# Altium project SPARTAN_BOARD.PrjPcb
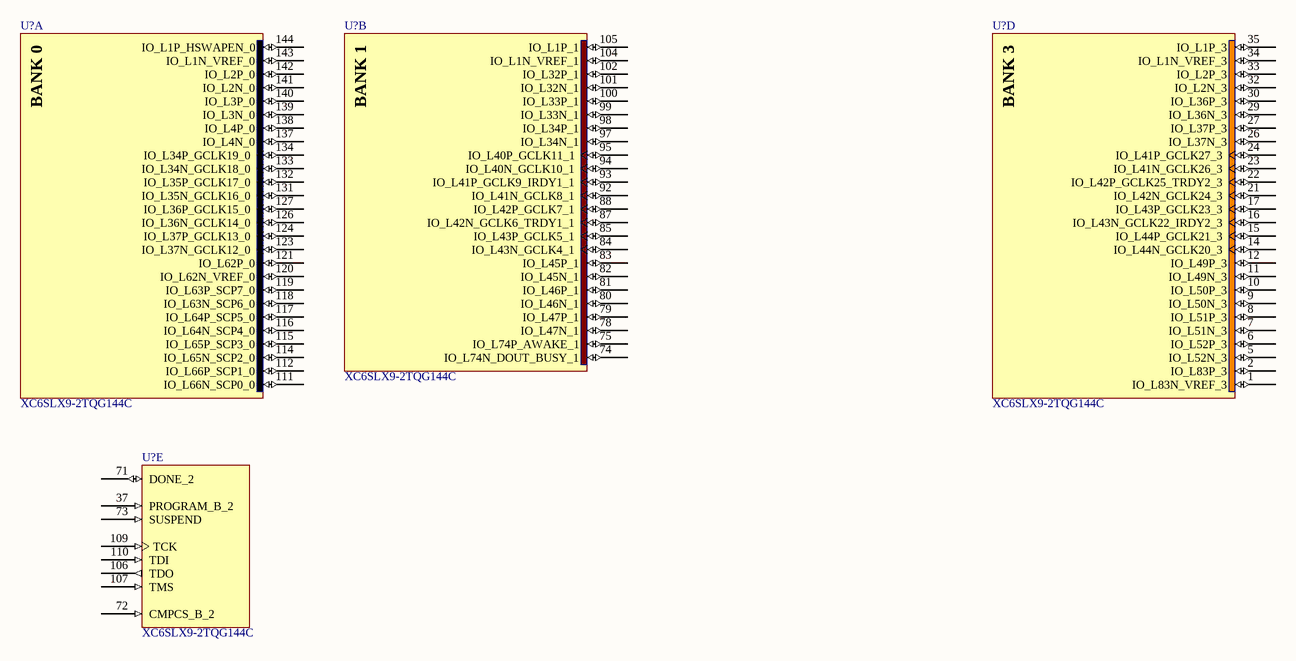
[diagram p0: Sheet1.SchDoc]
3 sheets, 33 parts. Net scope: global (net labels, ports and power ports of the same name join across sheets).
Sheets:
  Sheet1.SchDoc
  FPGA_POWER.SchDoc
  FPGA_FLASH.SchDoc

## Sheet Sheet1.SchDoc
size A4; SheetNumber: 1; SheetTotal: 3

### Parts
(Parts that share a designator on the sheet are numbered #1, #2 ... from top to bottom, then left to right.)
U?#1  XC6SLX9-2TQG144C  [TQG144_N]  (part A of 7)
U?#2  XC6SLX9-2TQG144C  [TQG144_N]  (part B of 7)
U?#3  XC6SLX9-2TQG144C  [TQG144_N]  (part D of 7)
U?#4  XC6SLX9-2TQG144C  [TQG144_N]  (part E of 7)

### Nets

Not connected (* = marked no-connect by the designer): U?#1 111(IO_L66N_SCP0_0) 112(IO_L66P_SCP1_0) 114(IO_L65N_SCP2_0) 115(IO_L65P_SCP3_0) 116(IO_L64N_SCP4_0) 117(IO_L64P_SCP5_0) 118(IO_L63N_SCP6_0) 119(IO_L63P_SCP7_0) 120(IO_L62N_VREF_0) 121(IO_L62P_0) 123(IO_L37N_GCLK12_0) 124(IO_L37P_GCLK13_0) 126(IO_L36N_GCLK14_0) 127(IO_L36P_GCLK15_0) 131(IO_L35N_GCLK16_0) 132(IO_L35P_GCLK17_0) 133(IO_L34N_GCLK18_0) 134(IO_L34P_GCLK19_0) 137(IO_L4N_0) 138(IO_L4P_0) 139(IO_L3N_0) 140(IO_L3P_0) 141(IO_L2N_0) 142(IO_L2P_0) 143(IO_L1N_VREF_0) 144(IO_L1P_HSWAPEN_0); U?#2 74(IO_L74N_DOUT_BUSY_1) 75(IO_L74P_AWAKE_1) 78(IO_L47N_1) 79(IO_L47P_1) 80(IO_L46N_1) 81(IO_L46P_1) 82(IO_L45N_1) 83(IO_L45P_1) 84(IO_L43N_GCLK4_1) 85(IO_L43P_GCLK5_1) 87(IO_L42N_GCLK6_TRDY1_1) 88(IO_L42P_GCLK7_1) 92(IO_L41N_GCLK8_1) 93(IO_L41P_GCLK9_IRDY1_1) 94(IO_L40N_GCLK10_1) 95(IO_L40P_GCLK11_1) 97(IO_L34N_1) 98(IO_L34P_1) 99(IO_L33N_1) 100(IO_L33P_1) 101(IO_L32N_1) 102(IO_L32P_1) 104(IO_L1N_VREF_1) 105(IO_L1P_1); U?#3 1(IO_L83N_VREF_3) 2(IO_L83P_3) 5(IO_L52N_3) 6(IO_L52P_3) 7(IO_L51N_3) 8(IO_L51P_3) 9(IO_L50N_3) 10(IO_L50P_3) 11(IO_L49N_3) 12(IO_L49P_3) 14(IO_L44N_GCLK20_3) 15(IO_L44P_GCLK21_3) 16(IO_L43N_GCLK22_IRDY2_3) 17(IO_L43P_GCLK23_3) 21(IO_L42N_GCLK24_3) 22(IO_L42P_GCLK25_TRDY2_3) 23(IO_L41N_GCLK26_3) 24(IO_L41P_GCLK27_3) 26(IO_L37N_3) 27(IO_L37P_3) 29(IO_L36N_3) 30(IO_L36P_3) 32(IO_L2N_3) 33(IO_L2P_3) 34(IO_L1N_VREF_3) 35(IO_L1P_3); U?#4 37(PROGRAM_B_2) 71(DONE_2) 72(CMPCS_B_2) 73(SUSPEND) 106(TDO) 107(TMS) 109(TCK) 110(TDI)

### Notes on the sheet
- (in symbol CMP-0067-00454-1, part A) BANK 0
- (in symbol CMP-0067-00454-1, part B) BANK 1
- (in symbol CMP-0067-00454-1, part D) BANK 3

### Library data of the parts
U?#1-U?#4 = CMP-0067-00454-1: Spartan-6 LX 1.2V FPGA, 102 User I/Os, 144-Pin TQFP (0.5mm Pitch), Speed Grade 2, Commercial Grade, Pb-Free; PackageVersion: ver1.2, Jun-2004; DatasheetVersion: ver1.6, Nov-2010; PackageDescription: 144-Pin Thin Quad Flat Pack (TQG144) - Pb-Free; PackageReference: TQG144; Code_JEDEC: MS-026-BFB

## Sheet FPGA_POWER.SchDoc
size A; SheetNumber: 2; SheetTotal: 2
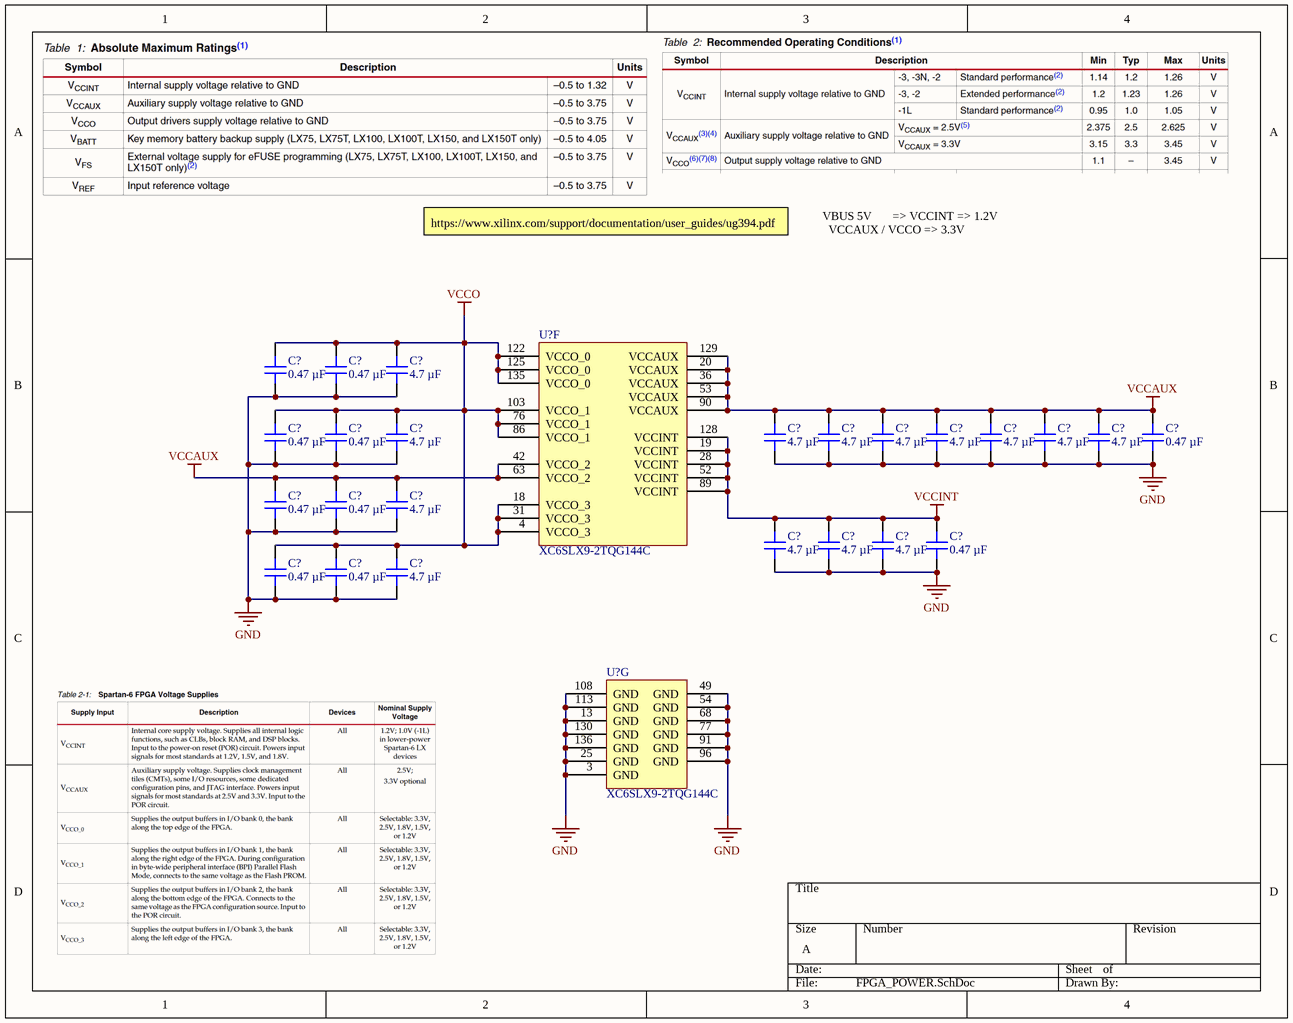
[diagram p1: FPGA_POWER.SchDoc]

### Parts
(Parts that share a designator on the sheet are numbered #1, #2 ... from top to bottom, then left to right.)
C?#1  0.47 µF  [CAP 0402_1005]
C?#2  0.47 µF  [CAP 0402_1005]
C?#3  4.7 µF  [CAP 0805_2012]
C?#4  0.47 µF  [CAP 0402_1005]
C?#5  0.47 µF  [CAP 0402_1005]
C?#6  4.7 µF  [CAP 0805_2012]
C?#7  4.7 µF  [CAP 0805_2012]
C?#8  4.7 µF  [CAP 0805_2012]
C?#9  4.7 µF  [CAP 0805_2012]
C?#10  4.7 µF  [CAP 0805_2012]
C?#11  4.7 µF  [CAP 0805_2012]
C?#12  4.7 µF  [CAP 0805_2012]
C?#13  4.7 µF  [CAP 0805_2012]
C?#14  0.47 µF  [CAP 0402_1005]
C?#15  0.47 µF  [CAP 0402_1005]
C?#16  0.47 µF  [CAP 0402_1005]
C?#17  4.7 µF  [CAP 0805_2012]
C?#18  4.7 µF  [CAP 0805_2012]
C?#19  4.7 µF  [CAP 0805_2012]
C?#20  4.7 µF  [CAP 0805_2012]
C?#21  0.47 µF  [CAP 0402_1005]
C?#22  0.47 µF  [CAP 0402_1005]
C?#23  0.47 µF  [CAP 0402_1005]
C?#24  4.7 µF  [CAP 0805_2012]
U?#5  XC6SLX9-2TQG144C  [TQG144_N]  (part F of 7)
U?#6  XC6SLX9-2TQG144C  [TQG144_N]  (part G of 7)

### Nets
GND: C?#1.1 C?#2.1 C?#3.1 C?#4.1 C?#5.1 C?#6.1 C?#7.1 C?#8.1 C?#9.1 C?#10.1 C?#11.1 C?#12.1 C?#13.1 C?#14.1 C?#15.1 C?#16.1 C?#17.1 C?#18.1 C?#19.1 C?#20.1 C?#21.1 C?#22.1 C?#23.1 C?#24.1 U?#6.3(GND) U?#6.13(GND) U?#6.25(GND) U?#6.49(GND) U?#6.54(GND) U?#6.68(GND) U?#6.77(GND) U?#6.91(GND) U?#6.96(GND) U?#6.108(GND) U?#6.113(GND) U?#6.130(GND) U?#6.136(GND)
VCCAUX: C?#7.2 C?#8.2 C?#9.2 C?#10.2 C?#11.2 C?#12.2 C?#13.2 C?#14.2 C?#15.2 C?#16.2 C?#17.2 U?#5.20(VCCAUX) U?#5.36(VCCAUX) U?#5.42(VCCO_2) U?#5.53(VCCAUX) U?#5.63(VCCO_2) U?#5.90(VCCAUX) U?#5.129(VCCAUX)
VCCINT: C?#18.2 C?#19.2 C?#20.2 C?#21.2 U?#5.19(VCCINT) U?#5.28(VCCINT) U?#5.52(VCCINT) U?#5.89(VCCINT) U?#5.128(VCCINT)
VCCO: C?#1.2 C?#2.2 C?#3.2 C?#4.2 C?#5.2 C?#6.2 C?#22.2 C?#23.2 C?#24.2 U?#5.4(VCCO_3) U?#5.18(VCCO_3) U?#5.31(VCCO_3) U?#5.76(VCCO_1) U?#5.86(VCCO_1) U?#5.103(VCCO_1) U?#5.122(VCCO_0) U?#5.125(VCCO_0) U?#5.135(VCCO_0)

### Notes on the sheet
- https://www.xilinx.com/support/documentation/user_guides/ug394.pdf
- VBUS 5V	      =>	VCCINT => 1.2V
  VCCAUX / VCCO => 3.3V

### Library data of the parts
C?#1 C?#2 C?#4 C?#5 C?#14-C?#16 C?#21-C?#23 = CL05A474KQ5NNNC: CAP CER 0.47UF 6.3V X5R 0402; manufacturer: Samsung Electro-Mechanics; Tolerance: ±10%; Part Number: CL05A474KQ5NNNC; Value: 0.47 µF; Applications: General Purpose; Capacitance: 0.47 µF; componentlink1description: Datasheet; componentlink1url: http://www.samsungsem.com/kr/support/product-search/mlcc/CL05A474KQ5NNNC.jsp; componentlink2description: DigiKey Link; componentlink2url: https://www.digikey.com/en/products/detail/samsung-electro-mechanics/CL05A474KQ5NNNC/3887137; Device Package: 0402 (1005 Metric); lastupdated: 2/26/2022 9:02:43 AM; Lifecycle Status: Active; Minimum Order: 1; Mounting Type: Surface Mount, MLCC; Operating Temperature: -55°C ~ 85°C; Package / Case: 0402 (1005 Metric); packaging: TapeAndReel; partid: 3146; Part Status: Active; price: 0.01; series: CL; Size / Dimension: 0.039" L x 0.020" W (1.00mm x 0.50mm); Supplier 1: DigiKey; Supplier Part Number 1: 1276-1479-1-ND; Temperature Coefficient: X5R; Thickness (Max): 0.022" (0.55mm); Voltage - Rated: 6.3V
C?#3 C?#6-C?#13 C?#17-C?#20 C?#24 = CL21A475KQFNNNG: CAP CER 4.7UF 6.3V X5R 0805; manufacturer: Samsung Electro-Mechanics; Tolerance: ±10%; Part Number: CL21A475KQFNNNG; Value: 4.7 µF; Applications: General Purpose; Capacitance: 4.7 µF; componentlink1description: Datasheet; componentlink1url: http://www.samsungsem.com/kr/support/product-search/mlcc/CL21A475KQFNNNG.jsp; componentlink2description: DigiKey Link; componentlink2url: https://www.digikey.com/en/products/detail/samsung-electro-mechanics/CL21A475KQFNNNG/3894444; Device Package: 0805 (2012 Metric); lastupdated: 2/28/2022 4:39:14 PM; Lifecycle Status: Active; Minimum Order: 1; Mounting Type: Surface Mount, MLCC; Operating Temperature: -55°C ~ 85°C; Package / Case: 0805 (2012 Metric); packaging: TapeAndReel; partid: 4972; Part Status: Active; price: 0.02; series: CL; Size / Dimension: 0.079" L x 0.049" W (2.00mm x 1.25mm); Supplier 1: DigiKey; Supplier Part Number 1: 1276-6465-1-ND; Temperature Coefficient: X5R; Thickness (Max): 0.053" (1.35mm); Voltage - Rated: 6.3V
U?#5 U?#6 = CMP-0067-00454-1: as U?#1 on sheet Sheet1; PackageVersion: ver1.2, Jun-2004; DatasheetVersion: ver1.6, Nov-2010; PackageDescription: 144-Pin Thin Quad Flat Pack (TQG144) - Pb-Free; PackageReference: TQG144; Code_JEDEC: MS-026-BFB

## Sheet FPGA_FLASH.SchDoc
size A; SheetNumber: 3; SheetTotal: 3
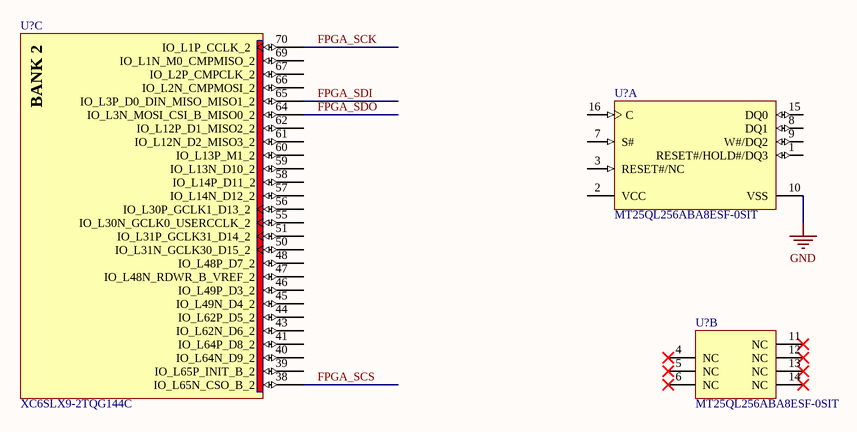
[diagram p2: FPGA_FLASH.SchDoc]

### Parts
(Parts that share a designator on the sheet are numbered #1, #2 ... from top to bottom, then left to right.)
U?#7  XC6SLX9-2TQG144C  [TQG144_N]  (part C of 7)
U?#8  MT25QL256ABA8ESF-0SIT  [MICT-SF-16_L]  (part A of 2)
U?#9  MT25QL256ABA8ESF-0SIT  [MICT-SF-16_L]  (part B of 2)

### Nets
GND: U?#8.10(VSS)
FPGA_SCK: U?#7.70(IO_L1P_CCLK_2)
FPGA_SCS: U?#7.38(IO_L65N_CSO_B_2)
FPGA_SDI: U?#7.65(IO_L3P_D0_DIN_MISO_MISO1_2)
FPGA_SDO: U?#7.64(IO_L3N_MOSI_CSI_B_MISO0_2)

Not connected (* = marked no-connect by the designer): U?#7 39(IO_L65P_INIT_B_2) 40(IO_L64N_D9_2) 41(IO_L64P_D8_2) 43(IO_L62N_D6_2) 44(IO_L62P_D5_2) 45(IO_L49N_D4_2) 46(IO_L49P_D3_2) 47(IO_L48N_RDWR_B_VREF_2) 48(IO_L48P_D7_2) 50(IO_L31N_GCLK30_D15_2) 51(IO_L31P_GCLK31_D14_2) 55(IO_L30N_GCLK0_USERCCLK_2) 56(IO_L30P_GCLK1_D13_2) 57(IO_L14N_D12_2) 58(IO_L14P_D11_2) 59(IO_L13N_D10_2) 60(IO_L13P_M1_2) 61(IO_L12N_D2_MISO3_2) 62(IO_L12P_D1_MISO2_2) 66(IO_L2N_CMPMOSI_2) 67(IO_L2P_CMPCLK_2) 69(IO_L1N_M0_CMPMISO_2); U?#8 1(RESET#/HOLD#/DQ3) 2(VCC) 3(RESET#/NC) 7(S#) 8(DQ1) 9(W#/DQ2) 15(DQ0) 16(C); U?#9 4(NC)* 5(NC)* 6(NC)* 11(NC)* 12(NC)* 13(NC)* 14(NC)*

### Notes on the sheet
- (in symbol CMP-0067-00454-1, part C) BANK 2

### Library data of the parts
U?#7 = CMP-0067-00454-1: as U?#1 on sheet Sheet1; PackageVersion: ver1.2, Jun-2004; DatasheetVersion: ver1.6, Nov-2010; PackageDescription: 144-Pin Thin Quad Flat Pack (TQG144) - Pb-Free; PackageReference: TQG144; Code_JEDEC: MS-026-BFB
U?#8 U?#9 = CMP-2000-07592-1: Micron Serial NOR Flash Memory, 256 Mbits, 2.7 to 3.6 V, -40 to 85 degC, 16-Pin SOP2 (SF), RoHS; Max Supply Voltage: 3.6V; Access Time: 6ns; Density: 256Mb; Operating Supply Voltage: 3.3V; Page Size: 256B; Min Supply Voltage: 2.7V; Min Operating Temperature: -40degC; Max Operating Temperature: 85degC; Manufacturer URL: http://www.micron.com/; Manufacturer: Micron; RoHSCompliant: True; Mounting Technology: SurfaceMount; Datasheet URL: https://www.micron.com/~/media/documents/products/data-sheet/nor-flash/serial-nor/mt25q/die-rev-a/mt25q_qljs_l_256_aba_0.pdf; Datasheet Version: Rev. I, 07/2017; Package Description: 16-Pin Small Outline Integrated Circuit Wide, Body 7.5 X 10.3 mm, Pitch 1.27 mm; Mount: SurfaceMount; Package Reference: SF-16; Memory Type: NOR; Interface: Serial

## Nets that join several sheets
GND: FPGA_POWER (37 pins), FPGA_FLASH (U?#8.10)